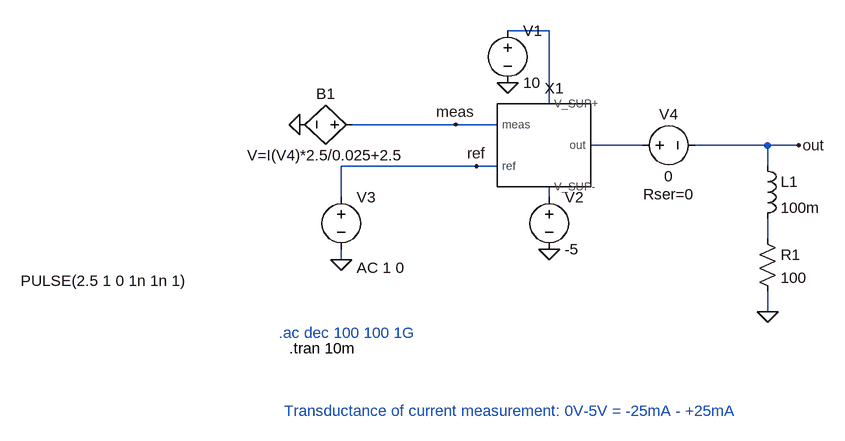
[diagram p0: schematic sim_control_I_L.asc]
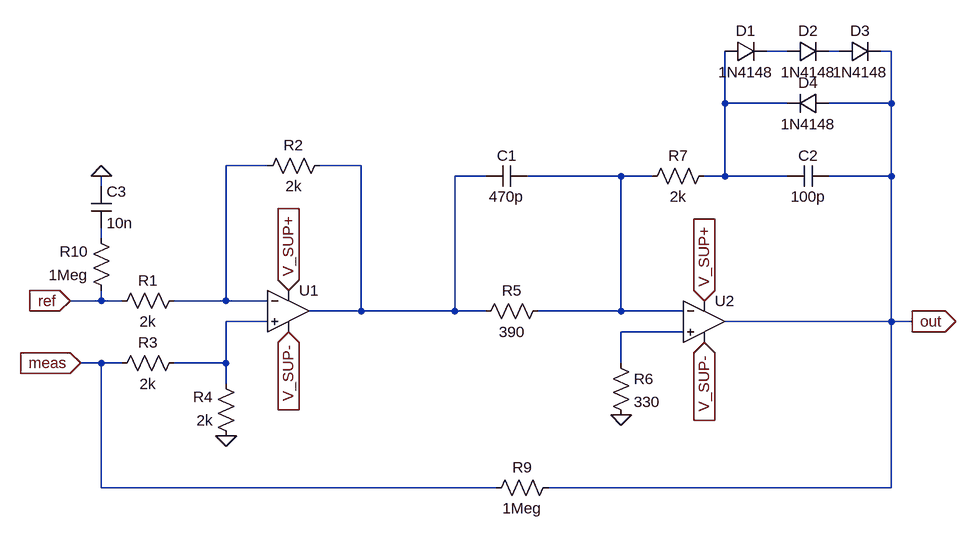
[diagram p1: sub-circuit control.asc]
sim_control_I_L.asc, the LTspice schematic file:
Version 4
SHEET 1 880 680
WIRE 208 -16 144 -16
WIRE 208 96 208 -16
WIRE 64 128 -96 128
WIRE 128 128 64 128
WIRE 352 160 272 160
WIRE 544 160 432 160
WIRE 592 160 544 160
WIRE 96 192 -112 192
WIRE 128 192 96 192
WIRE 544 192 544 160
WIRE -112 240 -112 192
WIRE 208 240 208 224
WIRE 544 304 544 272
WIRE -112 336 -112 320
WIRE 544 416 544 384
FLAG 208 320 0
FLAG 144 64 0
FLAG 592 160 out
FLAG 64 128 meas
FLAG 96 192 ref
FLAG -112 336 0
FLAG -176 128 0
FLAG 544 416 0
SYMBOL control 208 160 R0
SYMATTR InstName X1
SYMBOL voltage 144 -32 R0
WINDOW 123 0 0 Left 0
WINDOW 39 0 0 Left 0
SYMATTR InstName V1
SYMATTR Value 10
SYMBOL voltage 208 224 R0
WINDOW 123 0 0 Left 0
WINDOW 39 0 0 Left 0
SYMATTR InstName V2
SYMATTR Value -5
SYMBOL voltage -112 224 R0
WINDOW 123 24 124 Left 2
WINDOW 39 0 0 Left 0
WINDOW 3 -493 144 Left 2
SYMATTR Value2 AC 1 0
SYMATTR Value PULSE(2.5 1 0 1n 1n 1)
SYMATTR InstName V3
SYMBOL bv -80 128 R90
WINDOW 0 -32 56 VBottom 2
WINDOW 3 32 56 VTop 2
SYMATTR InstName B1
SYMATTR Value V=I(V4)*2.5/0.025+2.5
SYMBOL voltage 336 160 M90
WINDOW 0 -32 56 VBottom 2
WINDOW 3 32 56 VTop 2
WINDOW 123 0 0 Left 0
WINDOW 39 60 56 VTop 2
SYMATTR InstName V4
SYMATTR Value 0
SYMATTR SpiceLine Rser=0
SYMBOL ind 528 176 R0
SYMATTR InstName L1
SYMATTR Value 100m
SYMBOL res 528 288 R0
SYMATTR InstName R1
SYMATTR Value 100
TEXT -208 448 Left 2 ;.ac dec 100 100 1G
TEXT -200 568 Left 2 ;Transductance of current measurement: 0V-5V = -25mA - +25mA
TEXT -192 472 Left 2 !.tran 10m

control.asc, the sub-circuit schematic file:
Version 4
SHEET 1 1328 680
WIRE 1040 -256 1008 -256
WIRE 1120 -256 1104 -256
WIRE 1200 -256 1184 -256
WIRE 944 -176 944 -256
WIRE 1040 -176 944 -176
WIRE 1200 -176 1200 -256
WIRE 1200 -176 1104 -176
WIRE 240 -80 176 -80
WIRE 384 -80 320 -80
WIRE 576 -64 528 -64
WIRE 784 -64 640 -64
WIRE 832 -64 784 -64
WIRE 944 -64 944 -176
WIRE 944 -64 912 -64
WIRE 1040 -64 944 -64
WIRE 1200 -64 1200 -176
WIRE 1200 -64 1104 -64
WIRE -16 -48 -16 -64
WIRE -16 32 -16 16
WIRE -16 128 -16 112
WIRE -16 128 -64 128
WIRE 16 128 -16 128
WIRE 176 128 176 -80
WIRE 176 128 96 128
WIRE 240 128 176 128
WIRE 384 144 384 -80
WIRE 384 144 304 144
WIRE 528 144 528 -64
WIRE 528 144 384 144
WIRE 576 144 528 144
WIRE 784 144 784 -64
WIRE 784 144 656 144
WIRE 880 144 784 144
WIRE 240 160 176 160
WIRE 1200 160 1200 -64
WIRE 1200 160 944 160
WIRE 1232 160 1200 160
WIRE 880 176 784 176
WIRE -16 224 -48 224
WIRE 16 224 -16 224
WIRE 176 224 176 160
WIRE 176 224 96 224
WIRE 784 224 784 176
WIRE 176 256 176 224
WIRE -16 416 -16 224
WIRE 592 416 -16 416
WIRE 1200 416 1200 160
WIRE 1200 416 672 416
FLAG 272 112 V_SUP+
IOPIN 272 112 In
FLAG 272 176 V_SUP-
IOPIN 272 176 In
FLAG 912 128 V_SUP+
IOPIN 912 128 In
FLAG 912 192 V_SUP-
IOPIN 912 192 In
FLAG 176 336 0
FLAG -64 128 ref
IOPIN -64 128 In
FLAG -48 224 meas
IOPIN -48 224 In
FLAG 784 304 0
FLAG 1232 160 out
IOPIN 1232 160 Out
FLAG -16 -64 0
SYMBOL OpAmps\\UniversalOpAmp2 272 144 R0
SYMATTR InstName U1
SYMATTR Value2 Avol=500k GBW=70Meg Slew=200Meg
SYMATTR SpiceLine Ilimit=60m Rail=0 Vos=0
SYMATTR SpiceLine2 En=0 Enk=0 In=0 Ink=0 Rin=10G
SYMBOL OpAmps\\UniversalOpAmp2 912 160 R0
SYMATTR InstName U2
SYMATTR Value2 Avol=500k GBW=70Meg Slew=200Meg
SYMATTR SpiceLine Ilimit=60m Rail=0 Vos=0
SYMATTR SpiceLine2 En=0 Enk=0 In=0 Ink=0 Rin=10G
SYMBOL res 112 112 R90
WINDOW 0 0 56 VBottom 2
WINDOW 3 32 56 VTop 2
SYMATTR InstName R1
SYMATTR Value 2k
SYMBOL res 336 -96 R90
WINDOW 0 0 56 VBottom 2
WINDOW 3 32 56 VTop 2
SYMATTR InstName R2
SYMATTR Value 2k
SYMBOL res 112 208 R90
WINDOW 0 0 56 VBottom 2
WINDOW 3 32 56 VTop 2
SYMATTR InstName R3
SYMATTR Value 2k
SYMBOL res 192 352 R180
WINDOW 0 36 76 Left 2
WINDOW 3 36 40 Left 2
SYMATTR InstName R4
SYMATTR Value 2k
SYMBOL res 560 160 R270
WINDOW 0 32 56 VTop 2
WINDOW 3 0 56 VBottom 2
SYMATTR InstName R5
SYMATTR Value 390
SYMBOL res 768 208 R0
SYMATTR InstName R6
SYMATTR Value 330
SYMBOL res 688 400 R90
WINDOW 0 0 56 VBottom 2
WINDOW 3 32 56 VTop 2
SYMATTR InstName R9
SYMATTR Value 1Meg
SYMBOL res 0 128 R180
WINDOW 0 36 76 Left 2
WINDOW 3 36 40 Left 2
SYMATTR InstName R10
SYMATTR Value 1Meg
SYMBOL cap -32 -48 R0
SYMATTR InstName C3
SYMATTR Value 10n
SYMBOL diode 944 -240 R270
WINDOW 0 32 32 VTop 2
WINDOW 3 0 32 VBottom 2
SYMATTR InstName D1
SYMATTR Value 1N4148
SYMBOL diode 1040 -240 R270
WINDOW 0 32 32 VTop 2
WINDOW 3 0 32 VBottom 2
SYMATTR InstName D2
SYMATTR Value 1N4148
SYMBOL diode 1120 -240 R270
WINDOW 0 32 32 VTop 2
WINDOW 3 0 32 VBottom 2
SYMATTR InstName D3
SYMATTR Value 1N4148
SYMBOL diode 1104 -192 R90
WINDOW 0 0 32 VBottom 2
WINDOW 3 32 32 VTop 2
SYMATTR InstName D4
SYMATTR Value 1N4148
SYMBOL res 928 -80 R90
WINDOW 0 0 56 VBottom 2
WINDOW 3 32 56 VTop 2
SYMATTR InstName R7
SYMATTR Value 2k
SYMBOL cap 640 -80 R90
WINDOW 0 0 32 VBottom 2
WINDOW 3 32 32 VTop 2
SYMATTR InstName C1
SYMATTR Value 470p
SYMBOL cap 1104 -80 R90
WINDOW 0 0 32 VBottom 2
WINDOW 3 32 32 VTop 2
SYMATTR InstName C2
SYMATTR Value 100p

The netlist it stands for:
* sim_control_I_L.asc
XX1 meas ref N001 N003 N002 control
V1 N001 0 10
V2 N003 0 -5
V3 ref 0 PULSE(2.5 1 0 1n 1n 1) AC 1 0
B1 meas 0 V=I(V4)*2.5/0.025+2.5
V4 N002 out 0 Rser=0
L1 out N004 100m
R1 N004 0 100

* block symbol definitions
.subckt control meas ref V_SUP+ V_SUP- out
XU1 N008 N004 V_SUP+ V_SUP- N005 level2 Avol=500k GBW=70Meg Slew=200Meg Ilimit=60m Rail=0 Vos=0 En=0 Enk=0 In=0 Ink=0 Rin=10G  ; pins In+ In- V+ V- OUT
XU2 N009 N006 V_SUP+ V_SUP- out level2 Avol=500k GBW=70Meg Slew=200Meg Ilimit=60m Rail=0 Vos=0 En=0 Enk=0 In=0 Ink=0 Rin=10G  ; pins In+ In- V+ V- OUT
R1 N004 ref 2k
R2 N005 N004 2k
R3 N008 meas 2k
R4 0 N008 2k
R5 N005 N006 390
R6 N009 0 330
R9 out meas 1Meg
R10 ref N007 1Meg
C3 0 N007 10n
D1 N003 N001 1N4148
D2 N001 N002 1N4148
D3 N002 out 1N4148
D4 out N003 1N4148
R7 N003 N006 2k
C1 N006 N005 470p
C2 out N003 100p
.ends control

.model D D
.lib standard.dio
* .ac dec 100 100 1G
* Transductance of current measurement: 0V-5V = -25mA - +25mA
.tran 10m
.lib UniversalOpAmp2.lib
.backanno
.end